# Altium schematic sheet AudioAmplifier.SchDoc
size A4
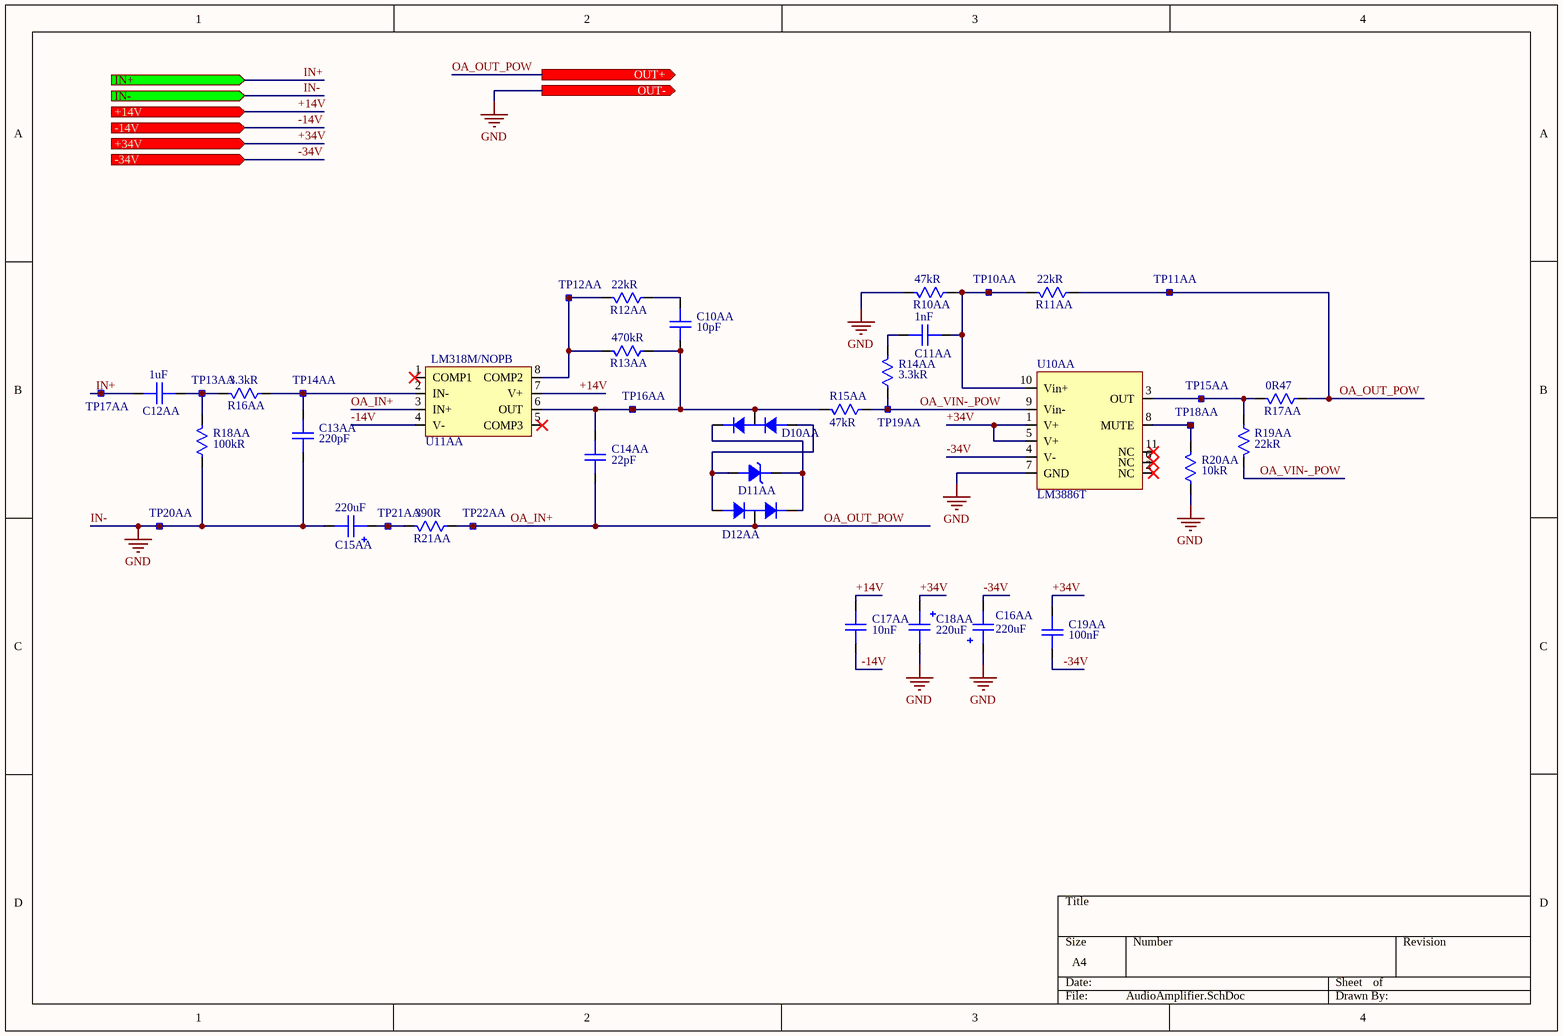
[diagram p0: AudioAmplifier.SchDoc]

## Parts
C10AA  Capacitance: 10pF  [CAPC2012X10N-GRM0805-MURATA]  (hidden comment: GRM21A5C2D100JW01D)
C11AA  Capacitance: 1nF  [CAPC2012X10N-GRM0805-MURATA]  (hidden comment: GRM219R72A102KA01D)
C12AA  Capacitance: 1uF  [Chip2PinSM127P600-8N-4030-SMD-PET-WIMA]  (hidden comment: SMDTC04100VA00KR00)
C13AA  Capacitance: 220pF  [CAPC2012X10N-GRM0805-MURATA]  (hidden comment: GRM219R72A221KA01D)
C14AA  Capacitance: 22pF  [CAPC2012X10N-GRM0805-MURATA]  (hidden comment: GRM21A5C2D220JW01D)
C15AA  Capacitance: 220uF  [Capacitor-KEMET-H4]  (hidden comment: ESH227M063AH4AA)
C16AA  Capacitance: 220uF  [Capacitor-KEMET-H4]  (hidden comment: ESH227M063AH4AA)
C17AA  Capacitance: 10nF  [CAPC2012X10N-GRM0805-MURATA]  (hidden comment: GRM219R72A103KA01D)
C18AA  Capacitance: 220uF  [Capacitor-KEMET-H4]  (hidden comment: ESH227M063AH4AA)
C19AA  Capacitance: 100nF  [CAPC2012X10N-GRM0805-MURATA]  (hidden comment: GRM21BR72A104KAC4L)
D10AA  BAV99W,LF  [SOT65P210X100-3N-SOT-323-TOSHIBA]  (value not drawn)
D11AA  BZV55-C27,115  [DIOMELF3515N-SOD80C-NEXPERIA]  (value not drawn)
D12AA  BAV99W,LF  [SOT65P210X100-3N-SOT-323-TOSHIBA]  (value not drawn)
R10AA  Resistance: 47kR  [Chip2PinSM127P600-8N-RK73H-1206-KOA]  (hidden comment: RK73H2BTTD4702F)
R11AA  Resistance: 22kR  [Chip2PinSM127P600-8N-RK73H-1206-KOA]  (hidden comment: RK73B2BTTDD223J)
R12AA  Resistance: 22kR  [Chip2PinSM127P600-8N-RK73H-1206-KOA]  (hidden comment: RK73B2BTTDD223J)
R13AA  Resistance: 470kR  [Chip2PinSM127P600-8N-RK73H-1206-KOA]  (hidden comment: SG732BTTD474K)
R14AA  Resistance: 3.3kR  [Chip2PinSM127P600-8N-RK73H-1206-KOA]  (hidden comment: RK73B2BTTDD332J)
R15AA  Resistance: 47kR  [Chip2PinSM127P600-8N-RK73H-1206-KOA]  (hidden comment: RK73H2BTTD4702F)
R16AA  Resistance: 3.3kR  [Chip2PinSM127P600-8N-RK73H-1206-KOA]  (hidden comment: RK73B2BTTDD332J)
R17AA  Resistance: 0R47  [Chip2PinSM127P600-8N-RWS7-OHMITE]  (hidden comment: RWS7 R47 J T&R)
R18AA  Resistance: 100kR  [Chip2PinSM127P600-8N-RK73H-1206-KOA]  (hidden comment: RK73B2BTTDD104J)
R19AA  Resistance: 22kR  [Chip2PinSM127P600-8N-RK73H-1206-KOA]  (hidden comment: RK73B2BTTDD223J)
R20AA  Resistance: 10kR  [Chip2PinSM127P600-8N-RK73H-1206-KOA]  (hidden comment: RK73B2BTTD103G)
R21AA  Resistance: 390R  [Chip2PinSM127P600-8N-RK73H-1206-KOA]  (hidden comment: RK73B2BTTDD391J)
TP10AA  TP_0.75mm  [Pad_0.75mm]  (value not drawn)  (no BOM)
TP11AA  TP_0.75mm  [Pad_0.75mm]  (value not drawn)  (no BOM)
TP12AA  TP_0.75mm  [Pad_0.75mm]  (value not drawn)  (no BOM)
TP13AA  TP_0.75mm  [Pad_0.75mm]  (value not drawn)  (no BOM)
TP14AA  TP_0.75mm  [Pad_0.75mm]  (value not drawn)  (no BOM)
TP15AA  TP_0.75mm  [Pad_0.75mm]  (value not drawn)  (no BOM)
TP16AA  TP_0.75mm  [Pad_0.75mm]  (value not drawn)  (no BOM)
TP17AA  TP_0.75mm  [Pad_0.75mm]  (value not drawn)  (no BOM)
TP18AA  TP_0.75mm  [Pad_0.75mm]  (value not drawn)  (no BOM)
TP19AA  TP_0.75mm  [Pad_0.75mm]  (value not drawn)  (no BOM)
TP20AA  TP_0.75mm  [Pad_0.75mm]  (value not drawn)  (no BOM)
TP21AA  TP_0.75mm  [Pad_0.75mm]  (value not drawn)  (no BOM)
TP22AA  TP_0.75mm  [Pad_0.75mm]  (value not drawn)  (no BOM)
U10AA  LM3886T  [TF11B]
U11AA  LM318M/NOPB  [SOIC127P600X175-8N-SOIC8-D0008A-TI]

## Ports
+14V (in), +34V (in), -14V (in), -34V (in), IN+ (in), IN- (in), OUT+ (out), OUT- (out)

## Nets
IN-: C13AA.1 C15AA.2 C16AA.1 C18AA.2 R10AA.1 R18AA.2 R20AA.2 TP20AA.?1 U10AA.7(GND) ; port IN-, port OUT-  [also labelled GND]
+14V: C17AA.2 U11AA.7(V+) ; port +14V
+34V: C18AA.1 C19AA.2 U10AA.1(V+) U10AA.5(V+) ; port +34V
-14V: C17AA.1 U11AA.4(V-) ; port -14V
-34V: C16AA.2 C19AA.1 U10AA.4(V-) ; port -34V
IN+: C12AA.2 TP17AA.?1 ; port IN+
OA_IN+: C14AA.2 D12AA.K1A2 R11AA.2 R17AA.2 R21AA.2 TP11AA.?1 TP22AA.?1 U11AA.3(IN+) ; port OUT+  [also labelled OA_OUT_POW]
OA_VIN-_POW: R14AA.2 R15AA.2 R19AA.1 TP19AA.?1 U10AA.9(Vin-)
NetC10AA_1: C10AA.1 C14AA.1 D10AA.K1A2 R13AA.2 R15AA.1 TP16AA.?1 U11AA.6(OUT)
NetC10AA_2: C10AA.2 R12AA.2
NetC11AA_1: C11AA.1 R10AA.2 R11AA.1 TP10AA.?1 U10AA.10(Vin+)
NetC11AA_2: C11AA.2 R14AA.1
NetC12AA_1: C12AA.1 R16AA.1 R18AA.1 TP13AA.?1
NetC13AA_2: C13AA.2 R16AA.2 TP14AA.?1 U11AA.2(IN-)
NetC15AA_1: C15AA.1 R21AA.1 TP21AA.?1
NetD10AA_A1: D10AA.A1 D11AA.A D12AA.A1
NetD10AA_K2: D10AA.K2 D11AA.K D12AA.K2
NetR12AA_1: R12AA.1 R13AA.1 TP12AA.?1 U11AA.8(COMP2)
NetR17AA_1: R17AA.1 R19AA.2 TP15AA.?1 U10AA.3(OUT)
NetR20AA_1: R20AA.1 TP18AA.?1 U10AA.8(MUTE)

Not connected (* = marked no-connect by the designer): U10AA 2(NC)* 6(NC)* 11(NC)*; U11AA 1(COMP1)* 5(COMP3)*

## Library data of the parts
C10AA = GRM21A5C2D100JW01D: Cap Ceramic 10pF 200V C0G 5% Pad SMD 0805 125C T/R; Manufacturer: Murata; Supplier 1: Arrow Electronics; Manufacturer Part Number: GRM21A5C2D100JW01D; RoHS: Yes; Category: Ceramic Capacitors; Stock 1: 3605; Pricing 1: 1=0.27880, 10=0.18960, 25=0.18290, 100=0.10650, 250=0.10520, 500=0.07580, 1000=0.06340, 3000=0.06300 (USD); Mount: Surface Mount; Case/Package: 0805; Min Operating Temperature: -55°C; Max Operating Temperature: 125°C; Packaging: Tape and Reel; Voltage Rating: 200V; Tolerance: 5%; Voltage Rating (DC): 200V; Dielectric: C0G; Length: 0.079inch; Width: 0.049inch; Thickness: 0.051inch; RoHS Compliant: Yes; ComponentLink1URL: https://search.murata.co.jp/Ceramy/image/img/A01X/G101/ENG/GRM21A5C2D100JW01-01.pdf?src-supplier=Digi-Key; ComponentLink1Description: https://search.murata.co.jp/Ceramy/image/img/A01X/G101/ENG/GRM21A5C2D100JW01-01.pdf?src-supplier=Digi-Key; ComponentLink2URL: http://search.murata.co.jp/Ceramy/image/img/A01X/G101/ENG/GRM21A5C2D100JW01-01.pdf?src-supplier=Digi-Key; ComponentLink2Description: http://search.murata.co.jp/Ceramy/image/img/A01X/G101/ENG/GRM21A5C2D100JW01-01.pdf?src-supplier=Digi-Key
C11AA = GRM219R72A102KA01D: 0805 1 nF 100 V ±10 % Tolerance X7R Surface Mount Multilayer Ceramic Capacitor; Manufacturer: Murata; Voltage Rating: 100V; Tolerance: 10%; Dissipation Factor: 0.025%; Supplier 1: Arrow Electronics; Manufacturer Part Number: GRM219R72A102KA01D; RoHS: Yes; Category: Ceramic Capacitors; Stock 1: 2320; Pricing 1: 1=0.16850, 10=0.12550, 25=0.12080, 100=0.06030, 250=0.05970, 500=0.04130, 1000=0.03450 (USD); Mount: Surface Mount; Case/Package: 0805; Case Code (Metric): 2012; Case Code (Imperial): 0805; Material: Ceramic; Dielectric Material: Ceramic; Min Operating Temperature: -55°C; Max Operating Temperature: 125°C; Package Quantity: 4000; Packaging: Tape and Reel; Voltage Rating (DC): 100V; Dielectric: X7R; Termination: SMD/SMT; Voltage: 100V; Series: GRM; Construction: Flat; Length: 2mm; Width: 0.049inch; Height: 0.85mm; Thickness: 0.037inch; Depth: 1.25mm; Radiation Hardening: No; Lead Free: Lead Free; RoHS Compliant: Yes; ComponentLink1URL: https://datasheet.ciiva.com/5418/product-5418996.pdf?src-supplier=Mouser; ComponentLink1Description: https://datasheet.ciiva.com/5418/product-5418996.pdf?src-supplier=Mouser; ComponentLink2URL: https://datasheet.ciiva.com/29200/452953-da-01-en-vs-kondensator-0805-29200622.pdf?src-supplier=Conrad; ComponentLink2Description: https://datasheet.ciiva.com/29200/452953-da-01-en-vs-kondensator-0805-29200622.pdf?src-supplier=Conrad; ComponentLink3URL: https://datasheet.ciiva.com/166/partnumbering-e-01-166386.pdf?src-supplier=Digi-Key; ComponentLink3Description: https://datasheet.ciiva.com/166/partnumbering-e-01-166386.pdf?src-supplier=Digi-Key; ComponentLink4URL: https://datasheet.ciiva.com/11621/c02e-11621626.pdf?src-supplier=Avnet; ComponentLink4Description: https://datasheet.ciiva.com/11621/c02e-11621626.pdf?src-supplier=Avnet; ComponentLink5URL: https://datasheet.ciiva.com/2989/c02e-2989678.pdf?src-supplier=Avnet; ComponentLink5Description: https://datasheet.ciiva.com/2989/c02e-2989678.pdf?src-supplier=Avnet
C12AA = SMDTC04100VA00KR00: Cap Film 1UF 10% 63VDC 4030; Manufacturer: WIMA; Voltage Rating: 63V; Voltage Rating (AC): 40V; Supplier 1: Mouser; Manufacturer Part Number: SMDTC04100VA00KR00; RoHS: Yes; Category: Film Capacitors; Stock 1: 709; Pricing 1: 1=1.62000, 10=1.29000, 50=1.29000, 100=0.96200, 1000=0.64100, 10000=0.55700 (USD); Case/Package: 4030; Min Operating Temperature: -55°C; Max Operating Temperature: 100°C; Package Quantity: 775; Packaging: Tape and Reel; Voltage Rating (DC): 63V; Tolerance: 10%; Termination: SMD/SMT; ComponentLink1URL: https://datasheet.ciiva.com/13373/wima-smd-pet-10719-13373865.pdf?src-supplier=Mouser; ComponentLink1Description: https://datasheet.ciiva.com/13373/wima-smd-pet-10719-13373865.pdf?src-supplier=Mouser
C13AA = GRM219R72A221KA01D: Cap Ceramic 220pF 100V X7R 10% SMD 0805 125°C Paper T/R; Manufacturer: Murata; Supplier 1: Mouser; Manufacturer Part Number: GRM219R72A221KA01D; RoHS: Yes; Category: Ceramic Capacitors; Stock 1: 2206; Pricing 1: 1=0.23000, 10=0.15800, 50=0.15800, 100=0.08800, 1000=0.05300, 10000=0.03900 (USD); Mount: Surface Mount; Case/Package: 0805; Case Code (Metric): 2012; Case Code (Imperial): 0805; Min Operating Temperature: -55°C; Max Operating Temperature: 125°C; Packaging: Tape and Reel; Tolerance: 10%; Package Quantity: 4000; Voltage Rating: 100V; Voltage Rating (DC): 100V; Dielectric: X7R; Termination: SMD/SMT; Series: GRM; Construction: Flat; Length: 2mm; Width: 0.049inch; Height: 0.85mm; Thickness: 0.037inch; Depth: 1.25mm; Radiation Hardening: No; RoHS Compliant: Yes; ComponentLink1URL: https://datasheet.ciiva.com/167/partnumbering-e-01-167705.pdf?src-supplier=Digi-Key; ComponentLink1Description: https://datasheet.ciiva.com/167/partnumbering-e-01-167705.pdf?src-supplier=Digi-Key
C14AA = GRM21A5C2D220JW01D: Cap Ceramic 22pF 200V C0G 5% SMD 0805 125°C Paper T/R; Manufacturer: Murata; Supplier 1: Arrow Electronics; Manufacturer Part Number: GRM21A5C2D220JW01D; RoHS: Yes; Category: Ceramic Capacitors; Stock 1: 2; Pricing 1: 1=0.04630 (USD); Mount: Surface Mount; Case/Package: 0805; Min Operating Temperature: -55°C; Max Operating Temperature: 125°C; Packaging: Tape and Reel; Voltage Rating: 200V; Tolerance: 5%; Voltage Rating (DC): 200V; Dielectric: C0G; Length: 0.079inch; Width: 0.049inch; Thickness: 0.051inch; RoHS Compliant: Yes; ComponentLink1URL: https://search.murata.co.jp/Ceramy/image/img/A01X/G101/ENG/GRM21A5C2D220JW01-01.pdf?src-supplier=Digi-Key; ComponentLink1Description: https://search.murata.co.jp/Ceramy/image/img/A01X/G101/ENG/GRM21A5C2D220JW01-01.pdf?src-supplier=Digi-Key; ComponentLink2URL: http://search.murata.co.jp/Ceramy/image/img/A01X/G101/ENG/GRM21A5C2D220JW01-01.pdf?src-supplier=Digi-Key; ComponentLink2Description: http://search.murata.co.jp/Ceramy/image/img/A01X/G101/ENG/GRM21A5C2D220JW01-01.pdf?src-supplier=Digi-Key
C15AA C16AA C18AA = ESH227M063AH4AA: Cap, 220ΜF, 63V, 20%; Manufacturer: KEMET; Life (Hours): 2000Hour; Supplier 1: Mouser; Manufacturer Part Number: ESH227M063AH4AA; RoHS: Yes; Category: Aluminum Electrolytic Capacitors; Stock 1: 236; Pricing 1: 1=0.58000, 10=0.40900, 50=0.30900, 100=0.26900, 1000=0.26900, 10000=0.26900 (USD); Case/Package: Radial; Min Operating Temperature: -25°C; Max Operating Temperature: 105°C; Tolerance: 20%; Voltage Rating: 63V; Voltage Rating (DC): 63V; Diameter: 10mm; Height: 19mm; Lead Pitch: 5mm; REACH SVHC: No SVHC; RoHS Compliant: Yes; ComponentLink1URL: https://datasheet.ciiva.com/22620/1794402-22620869.pdf?src-supplier=Element14; ComponentLink1Description: https://datasheet.ciiva.com/22620/1794402-22620869.pdf?src-supplier=Element14
C17AA = GRM219R72A103KA01D: Cap Ceramic 0.01uF 100V X7R 10% SMD 0805 125°C Paper T/R; Manufacturer: Murata; Supplier 1: Arrow Electronics; Manufacturer Part Number: GRM219R72A103KA01D; RoHS: Yes; Category: Ceramic Capacitors; Stock 1: 2008; Pricing 1: 1=0.19160, 10=0.16510, 25=0.16340, 100=0.07650, 250=0.07580, 500=0.05240, 1000=0.04340 (USD); Mount: Surface Mount; Case/Package: 0805; Case Code (Imperial): 0805; Case Code (Metric): 2012; Weight: 0.000335oz; Min Operating Temperature: -55°C; Max Operating Temperature: 125°C; Tolerance: 10%; Packaging: Tape and Reel; Dielectric: X7R; Voltage Rating: 100V; Termination: SMD/SMT; Resistor Type: Ceramic; Voltage Rating (DC): 100V; Package Quantity: 4000; Length: 2mm; Width: 0.049inch; Height: 0.85mm; Thickness: 0.037inch; Depth: 1.25mm; RoHS Compliant: Yes; ComponentLink1URL: http://www.mouser.com/ds/2/281/c02e-2905.pdf?src-supplier=Mouser; ComponentLink1Description: http://www.mouser.com/ds/2/281/c02e-2905.pdf?src-supplier=Mouser; ComponentLink2URL: https://search.murata.co.jp/Ceramy/image/img/A01X/G101/ENG/GRM219R72A103KA01-01.pdf?src-supplier=Digi-Key; ComponentLink2Description: https://search.murata.co.jp/Ceramy/image/img/A01X/G101/ENG/GRM219R72A103KA01-01.pdf?src-supplier=Digi-Key
C19AA = GRM21BR72A104KAC4L: 0805 0.1 uF 100 V ±10% Tolerance X7R SMT Multilayer Ceramic Capacitor; Manufacturer: Murata; Voltage Rating: 100V; Dissipation Factor: 0.05%; Supplier 1: Arrow Electronics; Manufacturer Part Number: GRM21BR72A104KAC4L; RoHS: Yes; Category: Ceramic Capacitors; Stock 1: 15610; Pricing 1: 1=0.26170, 10=0.12880, 25=0.12760, 100=0.10330, 250=0.10110, 500=0.07210, 1000=0.06190, 3000=0.06120, 6000=0.06030, 15000=0.05530 (USD); Mount: Surface Mount; Case/Package: 0805; Case Code (Metric): 2012; Case Code (Imperial): 0805; Dielectric Material: Ceramic; Min Operating Temperature: -55°C; Max Operating Temperature: 125°C; Packaging: Tape and Reel; Tolerance: 10%; Dielectric: X7R; Voltage: 100V; Termination: SMD/SMT; Voltage Rating (DC): 100V; Series: GRM; Construction: Flat; Length: 2mm; Width: 0.049inch; Height: 1.25mm; Thickness: 0.053inch; Depth: 1.25mm; Lead Free: Lead Free; RoHS Compliant: Yes; ComponentLink1URL: http://search.murata.co.jp/Ceramy/image/img/A01X/G101/ENG/GRM21BR72A104KAC4-01.pdf?src-supplier=Digi-Key; ComponentLink1Description: http://search.murata.co.jp/Ceramy/image/img/A01X/G101/ENG/GRM21BR72A104KAC4-01.pdf?src-supplier=Digi-Key
D10AA D12AA = BAV99W,LF: Switching Diode Series 0.9pF 100V 3-Pin SOT-323; pin to pad: A1>1 K1A2>3 K2>2; Manufacturer: Toshiba; Supplier 1: Mouser; Manufacturer Part Number: BAV99W,LF; RoHS: No; Category: Rectifier Diodes; Stock 1: 14403; Pricing 1: 1=0.22000, 10=0.20200, 50=0.20200, 100=0.11000, 1000=0.04700, 10000=0.03900 (USD)
D11AA = BZV55-C27,115: Zener diode BZV55C27 Hottech; SMD; MiniMELF, LL-34 (SOD-80); 27V; 0, 5W; 5%; pin to pad: A>2 K>1; Manufacturer: Nexperia; Supplier 1: Digi-Key; Manufacturer Part Number: BZV55-C27,115; RoHS: Yes; Category: Zener Diodes; Stock 1: 153; Pricing 1: 1=0.19000, 10=0.17500, 100=0.09520, 500=0.05856, 1000=0.03993 (USD); RoHS Compliant: Yes; ComponentLink1URL: http://www.farnell.com/datasheets/1498690.pdf?src-supplier=Farnell; ComponentLink1Description: http://www.farnell.com/datasheets/1498690.pdf?src-supplier=Farnell; ComponentLink2URL: https://assets.nexperia.com/documents/data-sheet/BZV55_SER.pdf?src-supplier=Digi-Key; ComponentLink2Description: https://assets.nexperia.com/documents/data-sheet/BZV55_SER.pdf?src-supplier=Digi-Key
R10AA R15AA = RK73H2BTTD4702F: Res Thick Film 1206 47K Ohm 1% 0.25W(1/4W) ±100ppm/C Pad SMD Automotive T/R; Manufacturer: KOA Speer; Power Rating: 250mW; Voltage Rating: 200V; Temperature Coefficient: 100ppm/°C; Supplier 1: Digi-Key; Manufacturer Part Number: RK73H2BTTD4702F; RoHS: Yes; Category: Chip SMD Resistors; Stock 1: 20654; Pricing 1: 1=0.10000, 10=0.06000, 100=0.02440, 1000=0.01097, 2500=0.00952 (USD); Case/Package: Molded; Number of Pins: 2; Case Code (Imperial): 1206; Case Code (Metric): 3216; Min Operating Temperature: -55°C; Max Operating Temperature: 155°C; Tolerance: 1%; Packaging: Tape and Reel; Termination: SMD/SMT; Resistor Type: Thick Film; Voltage Rating (DC): 200V; Series: RK73H; Resistance Tolerance: 1%; REACH SVHC: No SVHC; Lead Free: Lead Free; RoHS Compliant: Yes; ComponentLink1URL: https://datasheet.ciiva.com/22681/549017-22681256.pdf?src-supplier=Element14; ComponentLink1Description: https://datasheet.ciiva.com/22681/549017-22681256.pdf?src-supplier=Element14; ComponentLink2URL: https://datasheet.ciiva.com/5554/rk73h-5554329.pdf?src-supplier=Mouser; ComponentLink2Description: https://datasheet.ciiva.com/5554/rk73h-5554329.pdf?src-supplier=Mouser; ComponentLink3URL: https://datasheet.ciiva.com/48426/rk73h-series-eng-jap-tds-48426457.pdf?src-supplier=Distrelec; ComponentLink3Description: https://datasheet.ciiva.com/48426/rk73h-series-eng-jap-tds-48426457.pdf?src-supplier=Distrelec
R11AA R12AA R19AA = RK73B2BTTDD223J: Thick Film Resistors 1/4W 22K OHM 5%; Manufacturer: KOA Speer; Power Rating: 250mW; Voltage Rating: 200V; Temperature Coefficient: 200ppm/°C; Supplier 1: Mouser; Manufacturer Part Number: RK73B2BTTDD223J; RoHS: Yes; Category: Resistors; Stock 1: 4037; Pricing 1: 1=0.10000, 10=0.05300, 50=0.05300, 100=0.02200, 1000=0.01000, 10000=0.00600 (USD); Case/Package: 1206; Case Code (Imperial): 1206; Case Code (Metric): 3216; Min Operating Temperature: -55°C; Max Operating Temperature: 155°C; Tolerance: 5%; Packaging: Tape and Reel; Termination: SMD/SMT; Series: RK73B; Lead Free: Lead Free; RoHS Compliant: Yes; ComponentLink1URL: https://datasheet.ciiva.com/5557/rk73b-5557031.pdf?src-supplier=Mouser; ComponentLink1Description: https://datasheet.ciiva.com/5557/rk73b-5557031.pdf?src-supplier=Mouser
R13AA = SG732BTTD474K: anti-surge thick film chip resistor, 1206, RoHS; Manufacturer: KOA Speer; Tolerance: 10%; Power Rating: 250mW; Voltage Rating: 200V; Temperature Coefficient: 200ppm/°C; Supplier 1: Mouser; Manufacturer Part Number: SG732BTTD474K; RoHS: Yes; Category: Chip SMD Resistors; Stock 1: 3298; Pricing 1: 1=0.34000, 10=0.29100, 50=0.29100, 100=0.11600, 1000=0.05500, 10000=0.03700 (USD); Case/Package: 1206; Case Code (Imperial): 1206; Case Code (Metric): 3216; Min Operating Temperature: -55°C; Max Operating Temperature: 155°C; Packaging: Tape and Reel; Termination: SMD/SMT; Voltage Rating (DC): 200V; Series: SG73; RoHS Compliant: Yes; ComponentLink1URL: https://datasheet.ciiva.com/5561/sg73-5561962.pdf?src-supplier=Mouser; ComponentLink1Description: https://datasheet.ciiva.com/5561/sg73-5561962.pdf?src-supplier=Mouser
R14AA R16AA = RK73B2BTTDD332J: Thick Film Resistors 3.3K OHM 5%; Manufacturer: KOA Speer; Power Rating: 250mW; Voltage Rating: 200V; Temperature Coefficient: 200ppm/°C; Supplier 1: Mouser; Manufacturer Part Number: RK73B2BTTDD332J; RoHS: Yes; Category: Resistors; Stock 1: 4172; Pricing 1: 1=0.10000, 10=0.05300, 50=0.05300, 100=0.02200, 1000=0.01000, 10000=0.00700 (USD); Case/Package: 1206; Case Code (Imperial): 1206; Case Code (Metric): 3216; Min Operating Temperature: -55°C; Max Operating Temperature: 155°C; Tolerance: 5%; Packaging: Tape and Reel; Termination: SMD/SMT; Lead Free: Lead Free; ComponentLink1URL: http://www.mouser.com/ds/2/219/RK73B-919.pdf?src-supplier=Mouser; ComponentLink1Description: http://www.mouser.com/ds/2/219/RK73B-919.pdf?src-supplier=Mouser
R17AA = RWS7 R47 J T&R: 7 Watts Wirewound SMD 470 Milliohms 5% Tape Reel / ARCOL; Manufacturer: Ohmite; Supplier 1: Mouser; Manufacturer Part Number: RWS7 R47 J T&R; RoHS: Yes; Stock 1: 192; Pricing 1: 1=2.23000, 10=2.04000, 50=1.92000, 100=1.52000, 1000=0.92700, 10000=0.90000 (USD)
R18AA = RK73B2BTTDD104J: Thick Film Resistors - SMD 1/4watts 100Kohms 5%; Manufacturer: KOA Speer; Power Rating: 250mW; Voltage Rating: 200V; Temperature Coefficient: 200ppm/°C; Supplier 1: Mouser; Manufacturer Part Number: RK73B2BTTDD104J; RoHS: Yes; Category: Resistors; Stock 1: 4533; Pricing 1: 1=0.10000, 10=0.05300, 50=0.05300, 100=0.02200, 1000=0.01000, 10000=0.00900 (USD); Case/Package: 1206; Case Code (Imperial): 1206; Case Code (Metric): 3216; Min Operating Temperature: -55°C; Max Operating Temperature: 155°C; Tolerance: 5%; Packaging: Tape and Reel; Package Quantity: 10000; Resistor Type: Thick Film; Termination: SMD/SMT; Length: 3.2mm; Width: 1.6mm; Height: 0.6mm; Lead Free: Lead Free; ComponentLink1URL: https://datasheet.ciiva.com/5557/rk73b-5557336.pdf?src-supplier=Mouser; ComponentLink1Description: https://datasheet.ciiva.com/5557/rk73b-5557336.pdf?src-supplier=Mouser
R20AA = RK73B2BTTD103G: Res 10K Ohm 2% 1/4W 1206; Manufacturer: KOA Speer; Power Rating: 250mW; Temperature Coefficient: 200ppm/°C; Supplier 1: Mouser; Manufacturer Part Number: RK73B2BTTD103G; RoHS: Yes; Category: Chip SMD Resistors; Stock 1: 2830; Pricing 1: 1=0.10000, 10=0.08800, 50=0.08800, 100=0.03400, 1000=0.01500, 10000=0.01100 (USD); Min Operating Temperature: -55°C; Max Operating Temperature: 155°C; Tolerance: 2%; Resistor Type: Thick Film; Length: 3.2mm; Width: 1.6mm; Height: 0.6mm; RoHS Compliant: Yes
R21AA = RK73B2BTTDD391J: Thick Film Resistors - SMD 1/4W 390 OHM 5%; Manufacturer: KOA Speer; Power Rating: 250mW; Voltage Rating: 200V; Temperature Coefficient: 200ppm/°C; Supplier 1: Mouser; Manufacturer Part Number: RK73B2BTTDD391J; RoHS: Yes; Category: Chip SMD Resistors; Stock 1: 1283; Pricing 1: 1=0.10000, 10=0.05300, 50=0.05300, 100=0.02200, 1000=0.01000, 10000=0.00600 (USD); Case/Package: 1206; Case Code (Imperial): 1206; Case Code (Metric): 3216; Min Operating Temperature: -55°C; Max Operating Temperature: 155°C; Packaging: Tape and Reel; Package Quantity: 10000; Tolerance: 5%; Termination: SMD/SMT; Resistor Type: Thick Film; Series: RK73B; Length: 3.2mm; Width: 1.6mm; Height: 0.6mm; Lead Free: Lead Free; RoHS Compliant: Yes; ComponentLink1URL: http://www.koaspeer.com/catimages/Products/RK73B/RK73B.pdf?src-supplier=Mouser; ComponentLink1Description: http://www.koaspeer.com/catimages/Products/RK73B/RK73B.pdf?src-supplier=Mouser
TP10AA TP11AA TP12AA TP13AA TP14AA TP15AA TP16AA TP17AA TP18AA TP19AA TP20AA TP21AA TP22AA = TP_0.75mm: Pad testpoint with 0.75mm Diameter
U10AA = LM3886T: Audio Amp Speaker 1-CH Mono 68W Class-AB 11-Pin(11+Tab) TO-220 Rail; Manufacturer: TI National Semiconductor; Voltage Gain: 115dB; Min Supply Voltage: 20V; Max Supply Voltage: 84V; Min Dual Supply Voltage: 10V; Max Dual Supply Voltage: 42V; Gain Bandwidth Product: 8MHz; Power Supply Rejection Ratio (PSRR): 120dB; Common Mode Rejection Ratio: 85dB; Max Power Dissipation: 125W; Number of Channels: 1; Input Offset Voltage (Vos): 10mV; Input Bias Current: 1uA; Quiescent Current: 85mA; Supply Type: Single,Dual; Load Impedance: 8R; Max Output Current: 11.5A; Dual Supply Voltage: 28V; Supplier 1: Farnell; Manufacturer Part Number: LM3886T; RoHS: No; Category: Amplifiers - Op Amps, Buffer, Instrumentation; Pricing 1: 1=6.53000, 10=5.38000, 25=4.98000, 50=4.72000, 100=4.45000, 250=4.23000, 500=3.38000 (EUR); Mount: Through Hole; Case/Package: TO-220; Number of Pins: 11; Weight: 0.01lb; Min Operating Temperature: -20°C; Max Operating Temperature: 85°C; Output Power: 68W; Packaging: Rail/Tube; Package Quantity: 20; Unity Gain Bandwidth Product: 8MHz; Max Output Power: 68W; Power Dissipation: 125W; Output Current: 11.5A; Series: Overture™; Length: 20.02mm; Width: 4.5mm; Height: 10.69mm; Radiation Hardening: No; REACH SVHC: No SVHC; RoHS Compliant: No; ComponentLink1URL: https://datasheet.ciiva.com/1480/21456-1480999.pdf?src-supplier=Element14; ComponentLink1Description: https://datasheet.ciiva.com/1480/21456-1480999.pdf?src-supplier=Element14; ComponentLink2URL: https://datasheet.ciiva.com/26842/lm3886t-26842547.pdf?src-supplier=IIIC; ComponentLink2Description: https://datasheet.ciiva.com/26842/lm3886t-26842547.pdf?src-supplier=IIIC; Supplier Part Number 1: 9493603
U11AA = LM318M/NOPB: LM318-N Single 40V, 15MHZ, High; Manufacturer: TI National Semiconductor; Max Supply Voltage: 20V; Min Dual Supply Voltage: 5V; Max Power Dissipation: 500mW; Voltage Gain: 106.02dB; Nominal Supply Current: 10mA; Number of Channels: 1; Input Bias Current: 500nA; Input Offset Voltage (Vos): 4mV; Slew Rate: 70V/µs; Common Mode Rejection Ratio: 70dB; Operating Supply Current: 5mA; Output Current: 20mA; Amplifier Type: GENERAL PURPOSE; Supplier 1: Digi-Key; Manufacturer Part Number: LM318M/NOPB; RoHS: Yes; Category: Amplifiers - Op Amps, Buffer, Instrumentation; Stock 1: 575; Pricing 1: 1=1.57000, 10=1.41300, 25=1.33280, 100=1.13550, 250=1.06620, 500=0.93294, 1000=0.88013 (USD); Mount: Surface Mount; Case/Package: SOIC; Number of Pins: 8; Contact Plating: Tin,Matte; Min Operating Temperature: 0°C; Max Operating Temperature: 70°C; Package Quantity: 95; Packaging: Rail/Tube; Max Dual Supply Voltage: 20V; Number of Elements: 1; Power Dissipation: 500mW; Max Supply Current: 10mA; Supply Current: 10mA; Technology: BIPOLAR; Operating Supply Voltage: 20V; -3db Bandwidth: 15MHz; Number of Circuits: 1; Gain Bandwidth Product: 15MHz; Length: 5mm; Width: 4mm; Height: 1.5mm; Radiation Hardening: No; Lead Free: Lead Free; RoHS Compliant: Yes; ComponentLink1URL: https://datasheet.ciiva.com/25629/0900766b810fa293-25629045.pdf?src-supplier=RSComponents; ComponentLink1Description: https://datasheet.ciiva.com/25629/0900766b810fa293-25629045.pdf?src-supplier=RSComponents; ComponentLink2URL: https://datasheet.ciiva.com/19472/838031-19472597.pdf?src-supplier=Jameco; ComponentLink2Description: https://datasheet.ciiva.com/19472/838031-19472597.pdf?src-supplier=Jameco; ComponentLink3URL: https://datasheet.ciiva.com/14151/oelmx18-data-e-14151388.pdf?src-supplier=Distrelec; ComponentLink3Description: https://datasheet.ciiva.com/14151/oelmx18-data-e-14151388.pdf?src-supplier=Distrelec; ComponentLink4URL: https://datasheet.ciiva.com/2973/lm118-n-2973325.pdf?src-supplier=Avnet; ComponentLink4Description: https://datasheet.ciiva.com/2973/lm118-n-2973325.pdf?src-supplier=Avnet; ComponentLink5URL: https://datasheet.ciiva.com/6626/lm118-n-6626485.pdf?src-supplier=Digi-Key; ComponentLink5Description: https://datasheet.ciiva.com/6626/lm118-n-6626485.pdf?src-supplier=Digi-Key; ComponentLink6URL: https://datasheet.ciiva.com/48712/001010733-da-01-en-ic-op-amp-hi-slew-lm318m-nopb-soic-8-tid-48712454.pdf?src-supplier=Conrad; ComponentLink6Description: https://datasheet.ciiva.com/48712/001010733-da-01-en-ic-op-amp-hi-slew-lm318m-nopb-soic-8-tid-48712454.pdf?src-supplier=Conrad